# EAGLE design microcontroller-board (EAGLE 5.06)
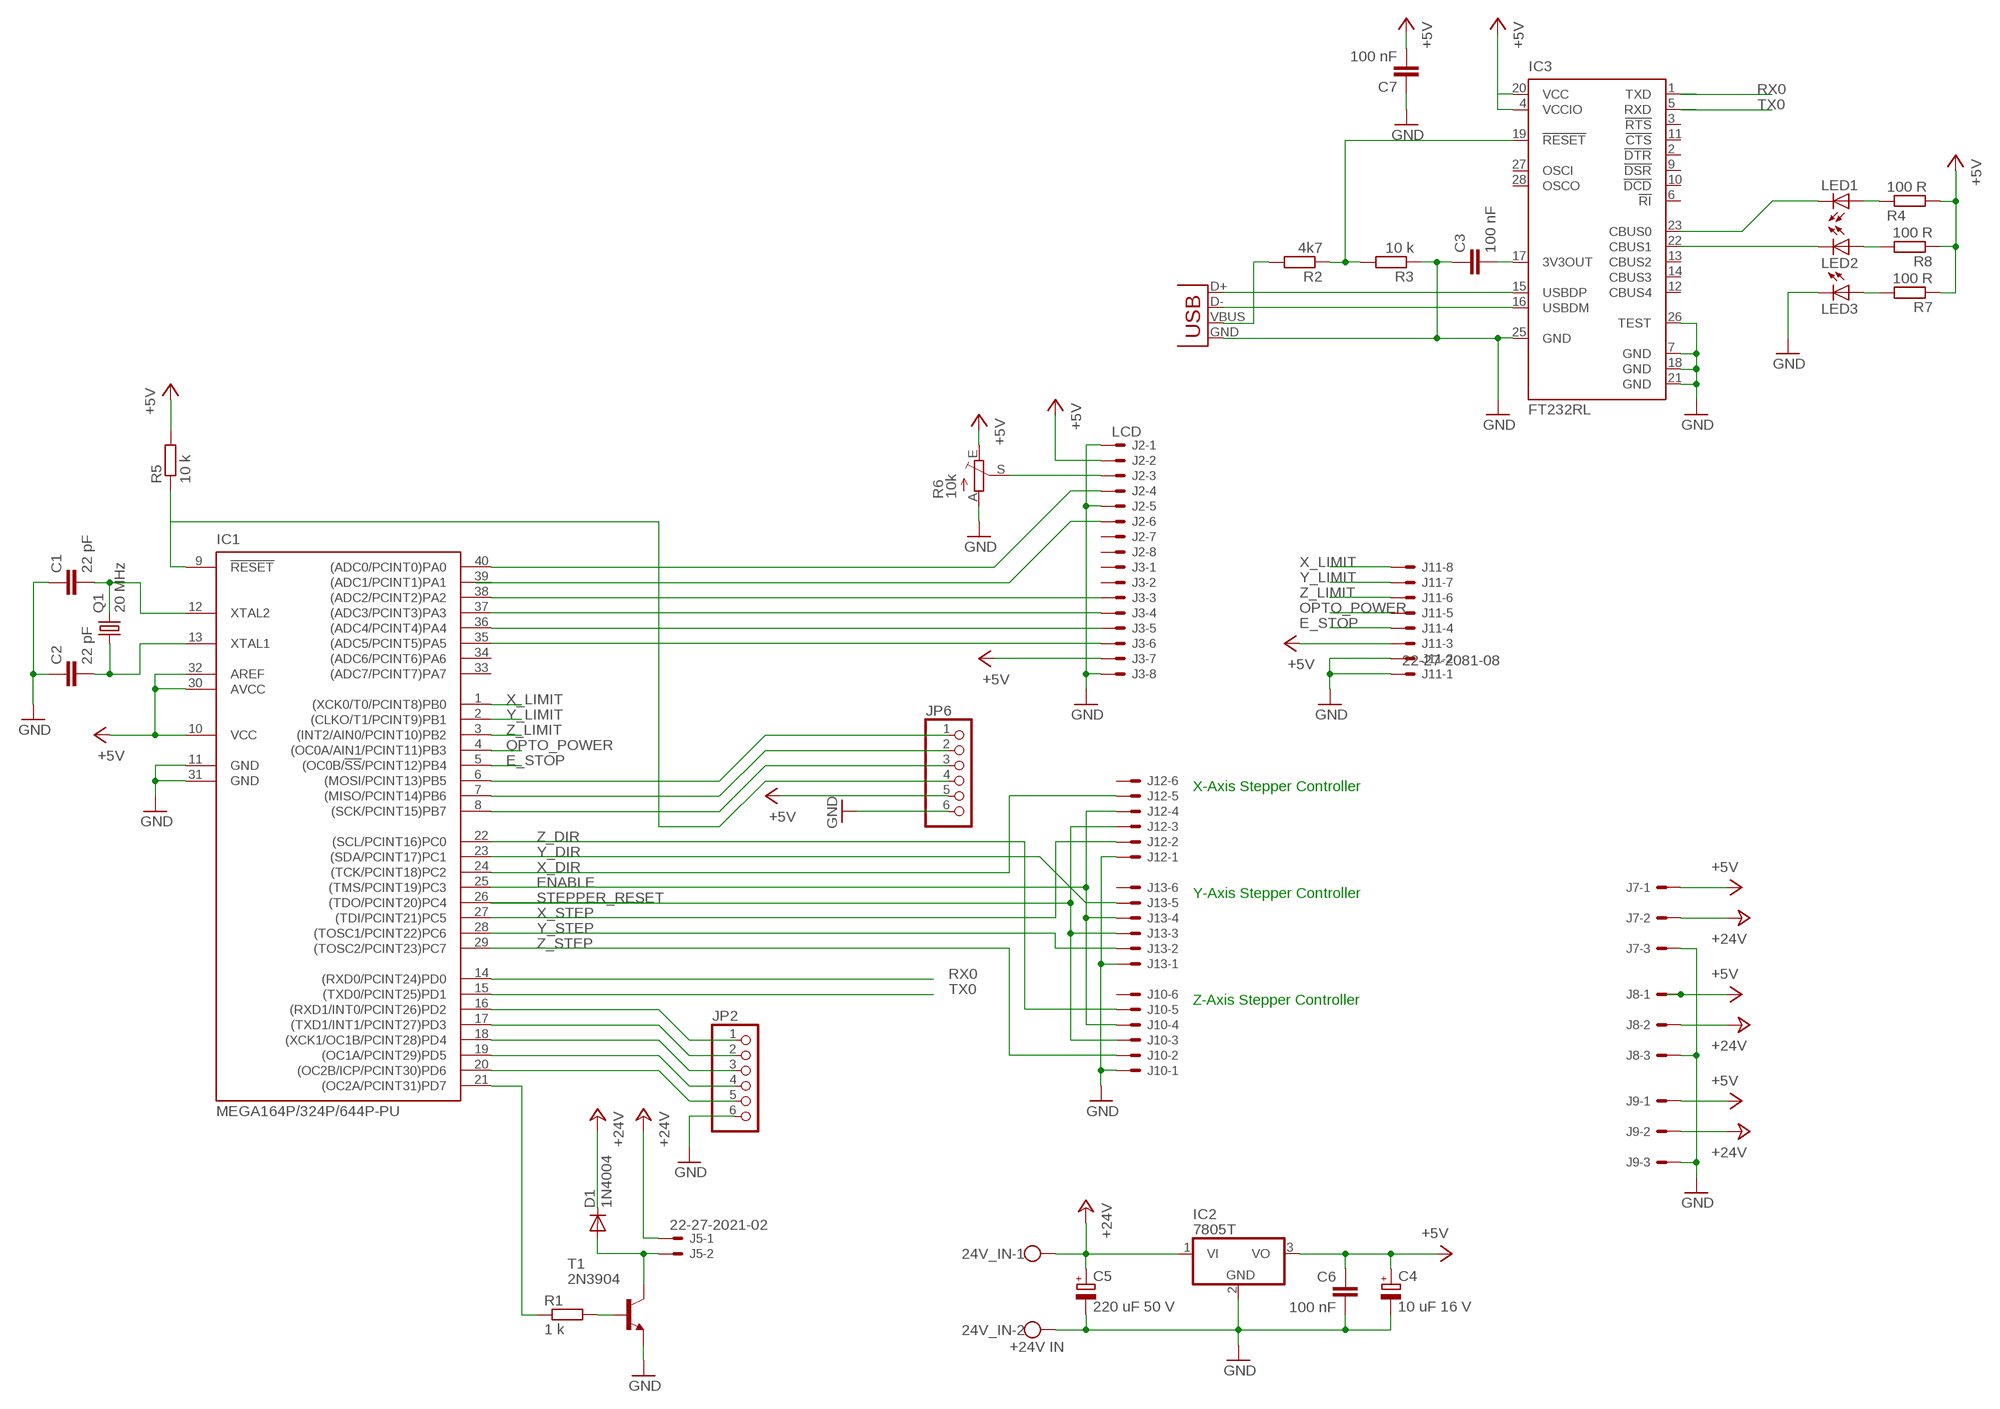
[diagram p0: schematic, sheet 1]

## Parts
24V_IN  +24V IN  W237-02P  [W237-132]
C1  22 pF  C-EUC0805  [C0805]
C2  22 pF  C-EUC0805  [C0805]
C3  100 nF  C-EU050-024X044  [C050-024X044]
C4  10 uF 16 V  CPOL-EUE5-5  [E5-5]
C5  220 uF 50 V  CPOL-EUE5-8.5  [E5-8,5]
C6  100 nF  C-EUC0805  [C0805]
C7  100 nF  C-EUC0805  [C0805]
D1  1N4004  BA243A  [DO35-10]
IC1  MEGA164P/324P/644P-PU  [DIL40]
IC2  7805T  [TO220H]
IC3  FT232RL  [SSOP28]
J2  LCD  22-27-2081-08  [6410-08]
J3  22-27-2081-08  [6410-08]
J5  22-27-2021-02  [6410-02]
J7  22-27-2031-03  [6410-03]
J8  22-27-2031-03  [6410-03]
J9  22-27-2031-03  [6410-03]
J10  22-27-2061-06  [6410-06]
J11  22-27-2081-08  [6410-08]
J12  22-27-2061-06  [6410-06]
J13  22-27-2061-06  [6410-06]
JP2  PINHD-1X6  [1X06]
JP6  PINHD-1X6  [1X06]
LED1  LEDCHIPLED_0805  [CHIPLED_0805]
LED2  LEDCHIPLED_0805  [CHIPLED_0805]
LED3  LEDCHIPLED_0805  [CHIPLED_0805]
Q1  20 MHz  CRYSTALHC49U-V  [HC49U-V]
R1  1 k  R-EU_0207/10  [0207/10]
R2  4k7  R-EU_M0805  [M0805]
R3  10 k  R-EU_M0805  [M0805]
R4  100 R  R-EU_M0805  [M0805]
R5  10 k  R-EU_M0805  [M0805]
R6  10k  TRIM_EU-PT10S  [PT-10S]
R7  100 R  R-EU_M0805  [M0805]
R8  100 R  R-EU_M0805  [M0805]
T1  2N3904  2N3903-NPN-TO92-EBC  [TO92-EBC]
X1  USBPTH  [USB-B-PTH]

## Nets
+5V: C4.+ C6.1 C7.2 IC1.10(VCC) IC1.30(AVCC) IC1.32(AREF) IC2.3(VO) IC3.4(VCCIO) IC3.20(VCC) J2.2 J3.7 J7.1 J8.1 J9.1 J11.3 JP6.5 R4.2 R5.2 R6.E R7.1 R8.1
+24V: 24V_IN.1 C5.+ D1.C IC2.1(VI) J5.1 J7.2 J8.2 J9.2
E_STOP: IC1.5((OC0B/!SS!/PCINT12)PB4) J11.4
ENABLE: IC1.25((TMS/PCINT19)PC3) J10.4 J12.4 J13.4
GND: 24V_IN.2 C1.1 C2.1 C3.1 C4.- C5.- C6.2 C7.1 IC1.11(GND) IC1.31(GND) IC2.2(GND) IC3.7(GND) IC3.18(GND) IC3.21(GND) IC3.25(GND) IC3.26(TEST) J2.1 J2.5 J3.8 J7.3 J8.3 J9.3 J10.1 J11.1 J11.2 J12.1 J13.1 JP2.6 JP6.6 LED3.C R3.1 R6.A T1.E X1.GND
N$1: C1.2 IC1.12(XTAL2) Q1.2
N$2: C2.2 IC1.13(XTAL1) Q1.1
N$4: J2.3 R6.S
N$5: IC1.39((ADC1/PCINT1)PA1) J2.6
N$6: IC1.35((ADC5/PCINT5)PA5) J3.6
N$7: R2.2 X1.VBUS
N$11: IC1.20((OC2B/ICP/PCINT30)PD6) JP2.5
N$12: IC1.36((ADC4/PCINT4)PA4) J3.5
N$13: IC1.9(!RESET) JP6.4 R5.1
N$14: IC1.38((ADC2/PCINT2)PA2) J3.3
N$15: IC1.19((OC1A/PCINT29)PD5) JP2.4
N$16: IC1.18((XCK1/OC1B/PCINT28)PD4) JP2.3
N$17: IC1.17((TXD1/INT1/PCINT27)PD3) JP2.2
N$18: IC1.16((RXD1/INT0/PCINT26)PD2) JP2.1
N$19: C3.2 IC3.17(3V3OUT)
N$20: IC1.37((ADC3/PCINT3)PA3) J3.4
N$21: IC1.8((SCK/PCINT15)PB7) JP6.3
N$22: IC1.6((MOSI/PCINT13)PB5) JP6.1
N$23: IC3.15(USBDP) X1.D+
N$24: IC3.16(USBDM) X1.D-
N$25: R1.2 T1.B
N$26: IC1.21((OC2A/PCINT31)PD7) R1.1
N$27: D1.A J5.2 T1.C
N$28: IC1.7((MISO/PCINT14)PB6) JP6.2
N$29: IC3.19(!RESET) R2.1 R3.2
N$31: IC1.40((ADC0/PCINT0)PA0) J2.4
N$33: IC3.22(CBUS1) LED2.C
N$35: IC3.23(CBUS0) LED1.C
N$36: LED1.A R4.1
N$37: LED2.A R8.2
N$39: LED3.A R7.2
OPTO_POWER: IC1.4((OC0A/AIN1/PCINT11)PB3) J11.5
RX0: IC1.14((RXD0/PCINT24)PD0) IC3.1(TXD)
STEPPER_RESET: IC1.26((TDO/PCINT20)PC4) J10.3 J12.3 J13.3
TX0: IC1.15((TXD0/PCINT25)PD1) IC3.5(RXD)
X_DIR: IC1.24((TCK/PCINT18)PC2) J12.5
X_LIMIT: IC1.1((XCK0/T0/PCINT8)PB0) J11.8
X_STEP: IC1.27((TDI/PCINT21)PC5) J12.2
Y_DIR: IC1.23((SDA/PCINT17)PC1) J13.5
Y_LIMIT: IC1.2((CLKO/T1/PCINT9)PB1) J11.7
Y_STEP: IC1.28((TOSC1/PCINT22)PC6) J13.2
Z_DIR: IC1.22((SCL/PCINT16)PC0) J10.5
Z_LIMIT: IC1.3((INT2/AIN0/PCINT10)PB2) J11.6
Z_STEP: IC1.29((TOSC2/PCINT23)PC7) J10.2
Unconnected: IC1.33((ADC7/PCINT7)PA7) IC1.34((ADC6/PCINT6)PA6) IC3.2(!DTR) IC3.3(!RTS) IC3.6(!RI) IC3.9(!DSR) IC3.10(!DCD) IC3.11(!CTS) IC3.12(CBUS4) IC3.13(CBUS2) IC3.14(CBUS3) IC3.27(OSCI) IC3.28(OSCO) J2.7 J2.8 J3.1 J3.2 J10.6 J12.6 J13.6

## Notes on the sheet
- X-Axis Stepper Controller
- Y-Axis Stepper Controller
- Z-Axis Stepper Controller

## Library data of the parts
24V_IN = con-wago-508:W237-02P: WAGO SREW CLAMP
C1-C3 C6 C7 = rcl:C-EU: CAPACITOR, European symbol
C4 C5 = rcl:CPOL-EU: POLARIZED CAPACITOR, European symbol
D1 = diode:BA243A: DIODE
IC1 = avr-5:MEGA164P/324P/644P-PU
IC2 = linear:78*: Positive VOLTAGE REGULATOR Source: http://cache.national.com/ds/LM/LM78L05.pdf http://www.fairchildsemi.com/ds/LM/LM7805.pdf
IC3 = ftdichip:FT232R: Source: http://www.ftdichip.com/Documents/DataSheets/DS_FT232R_v104.pdf
J2 J3 J11 = con-molex:22-?-08: CONNECTOR wire to board 2.54 mm (.1 inch) pitch header
J5 = con-molex:22-?-02: CONNECTOR wire to board 2.54 mm (.1 inch) pitch header
J7-J9 = con-molex:22-?-03: CONNECTOR wire to board 2.54 mm (.1 inch) pitch header
J10 J12 J13 = con-molex:22-?-06: CONNECTOR wire to board 2.54 mm (.1 inch) pitch header
JP2 JP6 = pinhead:PINHD-1X6: PIN HEADER
LED1-LED3 = led:LED: LED OSRAM: - CHIPLED LG R971, LG N971, LY N971, LG Q971, LY Q971, LO R971, LY R971 LH N974, LH R974 LS Q976, LO Q976, LY Q976 LO Q996 - Hyper CHIPLED LW Q18S LB Q993, LB Q99A, LB R99A - SideLED LS A670, LO A670, LY A670, LG A670, LP A670 LB A673, LV A673, LT A673, LW A673 LH A674 LY A675 LS A676, LA A676, LO A676, LY A676, LW A676 LS A679, LY A679, LG A679 - Hyper Micro SIDELED® LS Y876, LA Y876, LO Y876, LY Y876 LT Y87S - SmartLED LW L88C, LW L88S LB L89C, LB L89S, LG L890 LS L89K, LO L89K, LY L89K LS L896, LA L896, LO L896, LY L896 - TOPLED LS T670, LO T670, LY T670, LG T670, LP T670 LSG T670, LSP T670, LSY T670, LOP T670, LYG T670 LG T671, LOG T671, LSG T671 LB T673, LV T673, LT T673, LW T673 LH T674 LS T676, LA T676, LO T676, LY T676, LB T676, LH T676, LSB T676, LW T676 LB T67C, LV T67C, LT T67C, LS T67K, LO T67K, LY T67K, LW E67C LS E67B, LA E67B, LO E67B, LY E67B, LB E67C, LV E67C, LT E67C LW T67C LS T679, LY T679, LG T679 LS T770, LO T770, LY T770, LG T770, LP T770 LB T773, LV T773, LT T773, LW T773 LH T774 LS E675, LA E675, LY E675, LS T675 LS T776, LA T776, LO T776, LY T776, LB T776 LHGB T686 LT T68C, LB T68C - Hyper Mini TOPLED® LB M676 - Mini TOPLED Santana® LG M470 LS M47K, LO M47K, LY M47K Source: http://www.osram.convergy.de LUXEON: - LUMILED® LXK2-PW12-R00, LXK2-PW12-S00, LXK2-PW14-U00, LXK2-PW14-V00 LXK2-PM12-R00, LXK2-PM12-S00, LXK2-PM14-U00 LXK2-PE12-Q00, LXK2-PE12-R00, LXK2-PE12-S00, LXK2-PE14-T00, LXK2-PE14-U00 LXK2-PB12-K00, LXK2-PB12-L00, LXK2-PB12-M00, LXK2-PB14-N00, LXK2-PB14-P00, LXK2-PB14-Q00 LXK2-PR12-L00, LXK2-PR12-M00, LXK2-PR14-Q00, LXK2-PR14-R00 LXK2-PD12-Q00, LXK2-PD12-R00, LXK2-PD12-S00 LXK2-PH12-R00, LXK2-PH12-S00 LXK2-PL12-P00, LXK2-PL12-Q00, LXK2-PL12-R00 Source: www.luxeon.com KINGBRIGHT: KA-3528ASYC Source: www.kingbright.com
Q1 = crystal:CRYSTAL: CRYSTAL
R1-R5 R7 R8 = rcl:R-EU_: RESISTOR, European symbol
R6 = pot:TRIM_EU-: POTENTIOMETER
T1 = transistor-neu-to92:*-NPN-: NPN Transistror
X1 = SparkFun:USB: USB Connectors USB-B-PTH is fully proven SKU : PRT-00139 USB-miniB is fully proven SKU : PRT-00587 USB-A-PCB is untested. USB-A-H is throughly reviewed, but untested. Spark Fun Electronics SKU : PRT-00437 USB-B-SMT is throughly reviewed, but untested. Needs silkscreen touching up. USB-A-S has not been used/tested USB-MB-H has not been used/tested

## Board
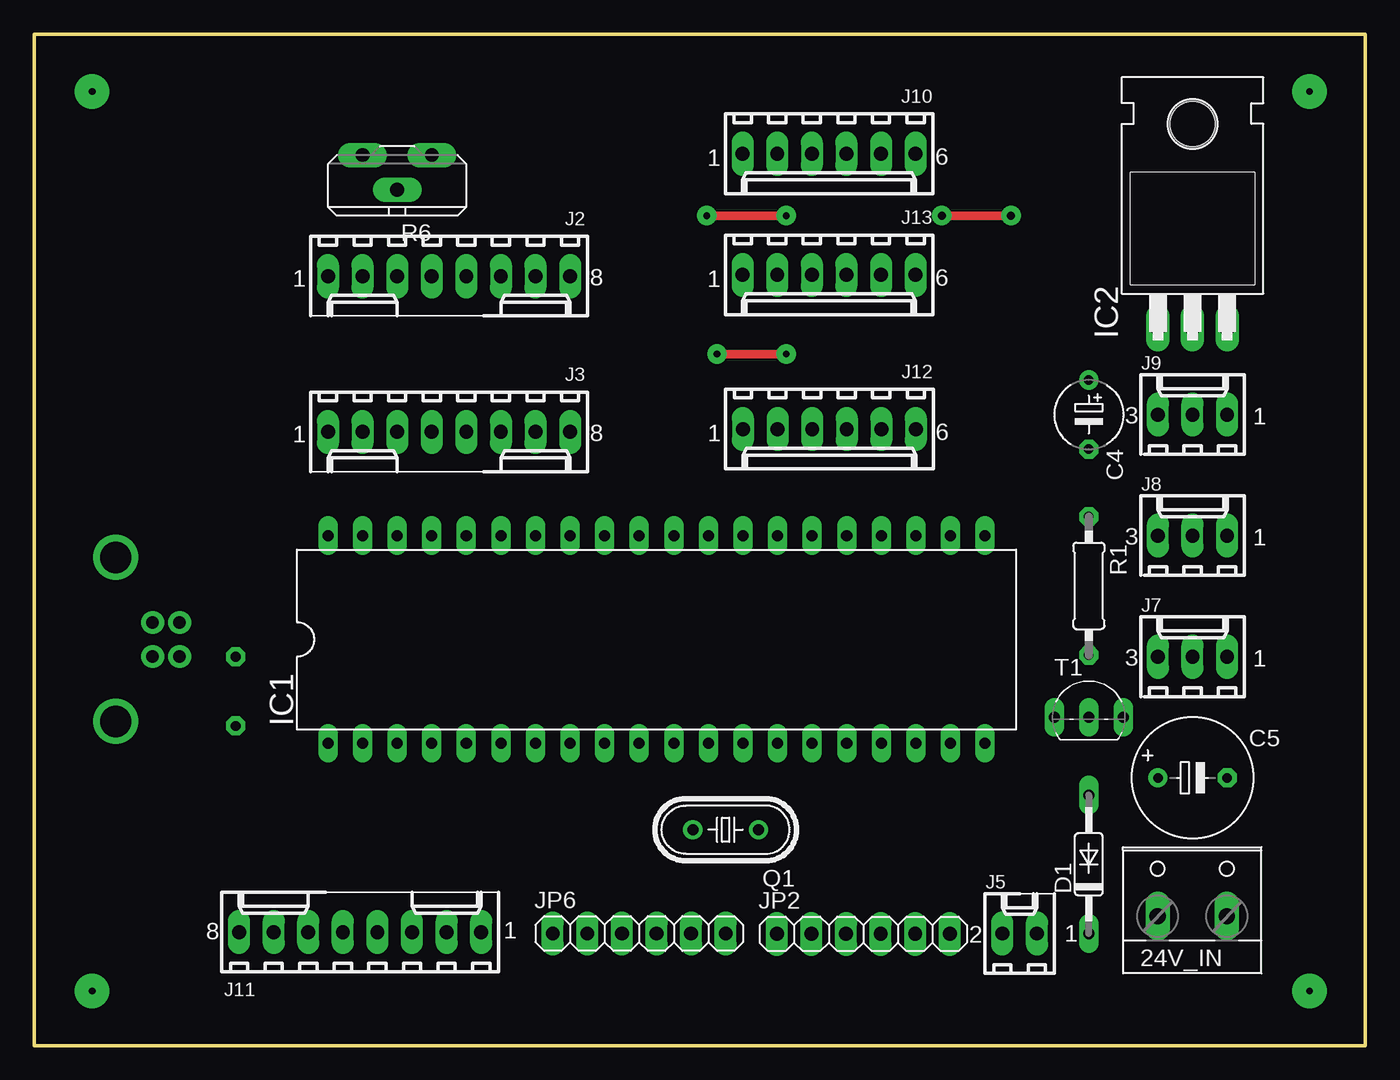
[diagram p1: board, top side]
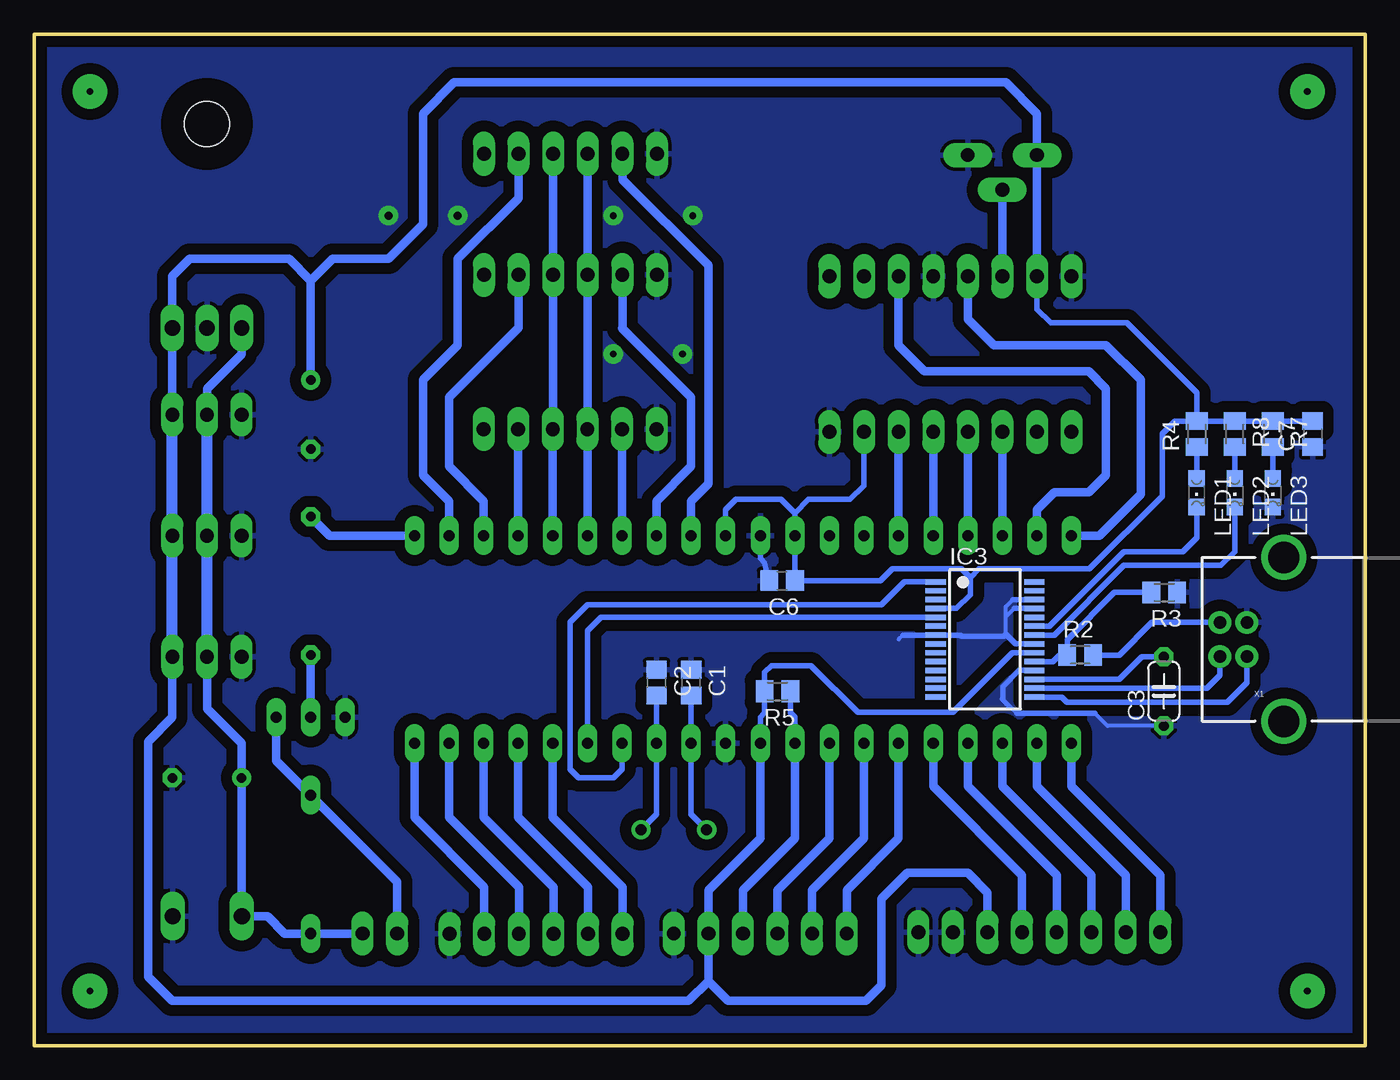
[diagram p2: board, bottom side, seen from below]

Size 97.79 x 74.3 mm. Coordinates in mm from the lower left corner, seen from the top.
Outline: 0,74.29 97.79,74.29 97.79,0 0,0 0,74.29
Copper layers (1*16): Top 0.035mm / dielectric 1.5mm / Bottom 0.035mm
Design rules "SparkFun": minimum track width 8mil, minimum drill 20mil, track to track 8mil, track to pad 8mil, pad to pad 8mil, via to via 8mil, smd to smd 8mil, copper to edge 10mil, drill to drill 8mil, minimum pad ring 12mil, minimum via ring 10mil, stop-mask expansion 4mil, vias tented up to drill 25mil, thermal gap 10mil

### Footprints (pad centres in the part's own frame; a part is rotated, then mirrored left to right if it is on the bottom)
W237-132 = drill 1.194 long: 1 -2.54,-0.635; 2 2.54,-0.635
C0805 = smd 1.3 x 1.5: 1 -0.95,0; 2 0.95,0
C050-024X044 = drill 0.7 pad 1.4 octagon: 1 -2.54,0; 2 2.54,0
E5-5 = drill 0.7 pad 1.4 round: + -2.54,0 | drill 0.7 pad 1.4 octagon: - 2.54,0
E5-8,5 = drill 0.7 pad 1.4 round: + -2.54,0 | drill 0.7 pad 1.4 octagon: - 2.54,0
DO35-10 = drill 0.813 long: A 5.08,0; C -5.08,0
DIL40 = drill 0.813 long: 1 -24.13,-7.62; 2 -21.59,-7.62; 3 -19.05,-7.62; 4 -16.51,-7.62; 5 -13.97,-7.62; 6 -11.43,-7.62; 7 -8.89,-7.62; 8 -6.35,-7.62; 9 -3.81,-7.62; 10 -1.27,-7.62; 11 1.27,-7.62; 12 3.81,-7.62; 13 6.35,-7.62; 14 8.89,-7.62; 15 11.43,-7.62; 16 13.97,-7.62; 17 16.51,-7.62; 18 19.05,-7.62; 19 21.59,-7.62; 20 24.13,-7.62; 21 24.13,7.62; 22 21.59,7.62; 23 19.05,7.62; 24 16.51,7.62; 25 13.97,7.62; 26 11.43,7.62; 27 8.89,7.62; 28 6.35,7.62; 29 3.81,7.62; 30 1.27,7.62; 31 -1.27,7.62; 32 -3.81,7.62; 33 -6.35,7.62; 34 -8.89,7.62; 35 -11.43,7.62; 36 -13.97,7.62; 37 -16.51,7.62; 38 -19.05,7.62; 39 -21.59,7.62; 40 -24.13,7.62
TO220H = drill 1.118 long: 1 -2.54,-10.16; 2 0,-10.16; 3 2.54,-10.16 | hole 3.302: 0,4.826
SSOP28 = smd 0.4 x 1.5: 1 -4.225,-3.625; 2 -3.575,-3.625; 3 -2.925,-3.625; 4 -2.275,-3.625; 5 -1.625,-3.625; 6 -0.975,-3.625; 7 -0.325,-3.625; 8 0.325,-3.625; 9 0.975,-3.625; 10 1.625,-3.625; 11 2.275,-3.625; 12 2.925,-3.625; 13 3.575,-3.625; 14 4.225,-3.625; 15 4.225,3.625; 16 3.575,3.625; 17 2.925,3.625; 18 2.275,3.625; 19 1.625,3.625; 20 0.975,3.625; 21 0.325,3.625; 22 -0.325,3.625; 23 -0.975,3.625; 24 -1.625,3.625; 25 -2.275,3.625; 26 -2.925,3.625; 27 -3.575,3.625; 28 -4.225,3.625
6410-08 = drill 1.016 long: 1 8.89,0; 2 6.35,0; 3 3.81,0; 4 1.27,0; 5 -1.27,0; 6 -3.81,0; 7 -6.35,0; 8 -8.89,0
6410-02 = drill 1.016 long: 1 1.27,0; 2 -1.27,0
6410-03 = drill 1.016 long: 1 2.54,0; 2 0,0; 3 -2.54,0
6410-06 = drill 1.016 long: 1 6.35,0; 2 3.81,0; 3 1.27,0; 4 -1.27,0; 5 -3.81,0; 6 -6.35,0
1X06 = drill 1.016 long: 1 -6.35,0; 2 -3.81,0; 3 -1.27,0; 4 1.27,0; 5 3.81,0; 6 6.35,0
CHIPLED_0805 = smd 1.2 x 1.2: A 0,-1.05; C 0,1.05
HC49U-V = drill 0.813 round: 1 -2.413,0; 2 2.413,0
0207/10 = drill 0.7 pad 1.4 octagon: 1 -5.08,0; 2 5.08,0
M0805 = smd 1.3 x 1.6: 1 -0.95,0; 2 0.95,0
PT-10S = drill 1 pad 1.8 long: A -2.54,-1.27; E 2.54,-1.27; S 0,1.27
TO92-EBC = drill 0.813 long: B 0,-1.27; C 2.54,-1.27; E -2.54,-1.27
USB-B-PTH = drill 0.914 pad 1.676 round: D+ 0,1.25; D- 1.981,1.25; GND 0,-1.25; VBUS 1.981,-1.25 | drill 2.286 round: P$1 -2.718,-6.02; P$2 -2.718,6.02

### Placement (x,y rotation side)
24V_IN  85.06,10.16 0 top
C1  49.53,26.67 270 bottom
C2  52.07,26.67 270 bottom
C3  14.81,26.04 90 bottom
C4  77.47,46.35 270 top
C5  85.09,19.68 0 top
C6  42.85,34.16 180 bottom
C7  3.89,44.93 90 bottom
D1  77.47,13.33 90 top
IC1  45.72,29.84 0 top
IC2  85.09,62.87 0 top
IC3  27.94,29.84 270 bottom
J2  30.48,56.52 180 top
J3  30.48,45.09 180 top
J5  72.39,8.25 0 top
J7  85.09,28.57 0 top
J8  85.09,37.46 0 top
J9  85.09,46.35 0 top
J10  58.39,65.51 180 top
J11  23.95,8.36 0 top
J12  58.42,45.29 180 top
J13  58.39,56.62 180 top
JP2  60.91,8.23 0 top
JP6  44.45,8.25 0 top
LED1  12.4,40.61 180 bottom
LED2  9.6,40.61 180 bottom
LED3  6.81,40.61 180 bottom
Q1  50.8,15.88 180 top
R1  77.47,33.78 270 top
R2  20.95,28.7 0 bottom
R3  14.78,33.3 180 bottom
R4  12.4,44.93 90 bottom
R5  43.18,26.04 180 bottom
R6  26.67,64.14 180 top
R7  6.81,44.93 270 bottom
R8  9.6,44.93 270 bottom
T1  77.47,25.4 0 top
X1  8.71,29.84 180 bottom

### Tracks (layer width: path | path; a pad name or v marks a point on that pad's centre or on a via)
+5V
  Bottom 0.406: J3.7 36.83,41.15 37.85,40.13 40.89,40.13 41.91,39.12 | 41.91,39.12 IC1.32 41.91,34.17 C6.1 35.61,34.16 34.75,35.03 29.67,35.03 29.03,34.39 | IC1.30 46.99,39.37 46.23,40.13 42.93,40.13 41.91,39.12 | J2.2 24.13,54.1 23.11,53.09 17.53,53.09 12.4,47.96 R4.2 | IC1.10 44.45,24.13 44.13,24.45 R5.2 44.13,27.42 43.64,27.91 40.72,27.91 37.29,24.49 30.3,24.49 25.92,28.87 IC3.20 | IC3.4 30.03,32.12 29.03,33.12 29.03,34.39 | R4.2 R8.1 R7.1 C7.2 | R4.2 13.99,45.88 14.94,44.93 14.94,40.36 20.27,35.03 28.4,35.03 29.03,34.39
  Bottom 0.61: J9.1 IC2.3 87.63,56.51 86.36,57.78 79.07,57.78 77.47,56.18 | J7.1 87.63,24.13 89.41,22.35 89.41,5.08 87.63,3.3 49.71,3.3 48.26,4.75 | J2.2 R6.E 24.13,68.45 26.42,70.74 66.93,70.74 69.22,68.45 69.22,60.32 71.76,57.78 75.87,57.78 77.47,56.18 | 44.45,15.24 48.26,11.43 JP6.5 48.26,4.75 | 44.45,15.24 IC1.10 | 44.45,15.24 44.45,16.82 | 48.26,4.75 46.81,3.3 36.7,3.3 35.56,4.44 35.56,10.79 33.66,12.7 29.21,12.7 27.76,11.25 J11.3 | 77.47,56.18 C4.+
  Bottom 0.813: J9.1 J8.1 J7.1
+24V
  Bottom 0.61: J7.2 85.09,24.76 82.55,22.22 C5.+ 82.55,9.52 24V_IN.1 80.65,9.52 79.38,8.25 D1.C J5.1 | IC2.1 82.55,50.8 85.09,48.26 J9.2
  Bottom 0.813: J9.2 J8.2 J7.2
E_STOP
  Bottom 0.61: IC1.5 31.75,19.05 25.22,12.52 J11.4
ENABLE
  Bottom 0.61: IC1.25 J12.4 59.66,45.31 59.66,55.93 | 59.66,55.93 J13.4 | 59.66,55.93 J10.4
GND  (via drill 0.5 pad 1.42, 0.6 pad 1.42)
  Top 0.61: v49.4,60.96 v55.25,60.96 | v50.17,50.8 v55.25,50.8 | v66.68,60.96 v71.76,60.96
  Bottom 0.305: 33.97,30.17 34.29,29.84 | 25.9,32.77 26.42,32.26 26.42,31.5 | 26.42,30.23 26.42,31.5 | 26.42,31.5 25.79,32.12 | 26.04,24.76 26.67,25.4 26.67,25.5 25.6,24.43 | 19.89,24.43 18.95,23.49 C3.1
  Bottom 0.406: IC3.21 25.71,29.52 26.42,30.23 26.57,30.07 29.67,30.07 29.76,30.17 IC3.7 33.97,30.17 | C6.2 44.13,35.49 44.45,35.81 IC1.31 | 19.89,24.43 25.6,24.43 | 25.79,32.12 IC3.25 | 25.9,32.77 IC3.26 | IC3.18 25.44,27.57 26.62,26.39 26.62,25.55 26.67,25.5
  pour Bottom (isolate 0.813): 97.92,74.42 97.79,0 0,0 0.13,74.42
N$1
  Bottom 0.406: Q1.2 49.53,17.02 IC1.12 C1.2
N$2
  Bottom 0.406: Q1.1 52.07,17.02 IC1.13 C2.2
N$3  (via drill 0.5 pad 2.54)
  other vias: 4.27,70.08
N$4
  Bottom 0.61: J2.3 R6.S
N$5
  Bottom 0.61: IC1.39 24.13,39.37 22.86,40.64 20.32,40.64 19.05,41.91 19.05,48.26 20.32,49.53 32.39,49.53 34.29,51.43 J2.6
N$6
  Bottom 0.61: IC1.35 J3.6
N$7
  Bottom 0.406: X1.VBUS 15.7,31.09 | 15.7,31.09 15.71,31.09 | R2.2 18.09,28.7 15.7,31.09
N$8  (via drill 0.5 pad 2.54)
  other vias: 4.27,4.04
N$9  (via drill 0.5 pad 2.54)
  other vias: 93.68,4.04
N$10  (via drill 0.5 pad 2.54)
  other vias: 93.68,70.08
N$11
  Bottom 0.61: IC1.20 69.85,16.79 64.72,11.66 JP2.5
N$12
  Bottom 0.61: IC1.36 J3.5
N$13
  Bottom 0.406: R5.1 42.23,24.45 41.91,24.13 IC1.9
  Bottom 0.61: IC1.9 41.91,15.24 45.72,11.43 JP6.4
N$14
  Bottom 0.61: IC1.38 J3.3
N$15
  Bottom 0.61: IC1.19 67.31,16.79 62.18,11.66 JP2.4
N$16
  Bottom 0.61: IC1.18 64.77,16.79 59.64,11.66 JP2.3
N$17
  Bottom 0.61: JP2.2 57.1,11.66 62.23,16.79 IC1.17
N$18
  Bottom 0.61: IC1.16 59.69,16.79 54.56,11.66 JP2.1
N$19
  Bottom 0.406: IC3.17 18.09,26.92 16.43,28.57 C3.2
N$20
  Bottom 0.61: IC1.37 J3.4
N$21
  Bottom 0.61: IC1.8 39.37,15.24 43.18,11.43 JP6.3
N$22
  Bottom 0.61: IC1.6 34.29,15.24 38.1,11.43 JP6.1
N$23
  Bottom 0.406: X1.D+ 8.71,26.67 10.13,25.25 21.92,25.25 22.29,25.62 IC3.15
N$24
  Bottom 0.406: X1.D- 10.69,27.23 11.65,26.27 IC3.16
N$25
  Bottom 0.61: T1.B R1.2
N$26
  Bottom 0.61: IC1.21 76.07,37.46 R1.1
N$27
  Bottom 0.61: J5.2 71.12,12.06 D1.A 80.01,20.95 T1.C
N$28
  Bottom 0.61: IC1.7 36.83,15.24 40.64,11.43 JP6.2
N$29
  Bottom 0.305: R2.1 22.48,28.7
  Bottom 0.406: IC3.19 22.96,28.22 22.48,28.7 | R2.1 21.91,29.83 18.44,33.3 R3.2
N$31
  Bottom 0.61: IC1.40 19.56,37.46 16.51,40.51 16.51,48.89 19.05,51.43 27.31,51.43 29.21,53.34 J2.4
N$33
  Bottom 0.406: LED2.C 9.6,36.3 10.62,35.28 16.71,35.28 17.73,35.28 22.84,30.17 IC3.22
N$35
  Bottom 0.305: 15.7,36.3 16.97,36.3
  Bottom 0.406: LED1.C 12.4,37.31 13.41,36.3 15.7,36.3 17.73,36.3 23.21,30.82 IC3.23
N$36
  Bottom 0.406: LED1.A R4.1
N$37
  Bottom 0.406: LED2.A R8.2
N$39
  Bottom 0.406: LED3.A R7.2
OPTO_POWER
  Bottom 0.61: IC1.4 29.21,19.05 22.68,12.52 J11.5
RX0
  Bottom 0.406: IC1.14 54.61,20.32 55.25,19.68 57.79,19.68 58.42,20.32 58.42,31.11 57.15,32.38 35.56,32.38 33.88,34.07 IC3.1
STEPPER_RESET
  Bottom 0.61: J10.3 J13.3 57.12,45.31 J12.3 IC1.26
TX0
  Bottom 0.406: IC3.5 56.16,31.47 57.15,30.48 IC1.15
X_DIR
  Bottom 0.61: IC1.24 J12.5
X_LIMIT
  Bottom 0.61: IC1.1 21.59,19.05 15.06,12.52 J11.8
X_STEP
  Bottom 0.61: IC1.27 J12.2
Y_DIR
  Bottom 0.61: IC1.23 64.77,40 67.31,42.54 67.31,47.62 62.2,52.73 J13.5
Y_LIMIT
  Bottom 0.61: IC1.2 24.13,19.05 17.6,12.52 J11.7
Y_STEP
  Bottom 0.61: IC1.28 52.07,40 49.53,42.54 49.53,47.62 54.61,52.7 54.58,52.73 J13.2
Z_DIR
  Bottom 0.61: IC1.22 67.31,40 69.22,41.91 69.22,48.89 66.68,51.43 66.68,57.78 62.2,62.26 J10.5
Z_LIMIT
  Bottom 0.61: IC1.3 26.67,19.05 20.14,12.52 J11.6
Z_STEP
  Bottom 0.61: IC1.29 49.53,40 48.26,41.27 48.26,57.3 54.56,63.6 54.56,65.48 J10.2